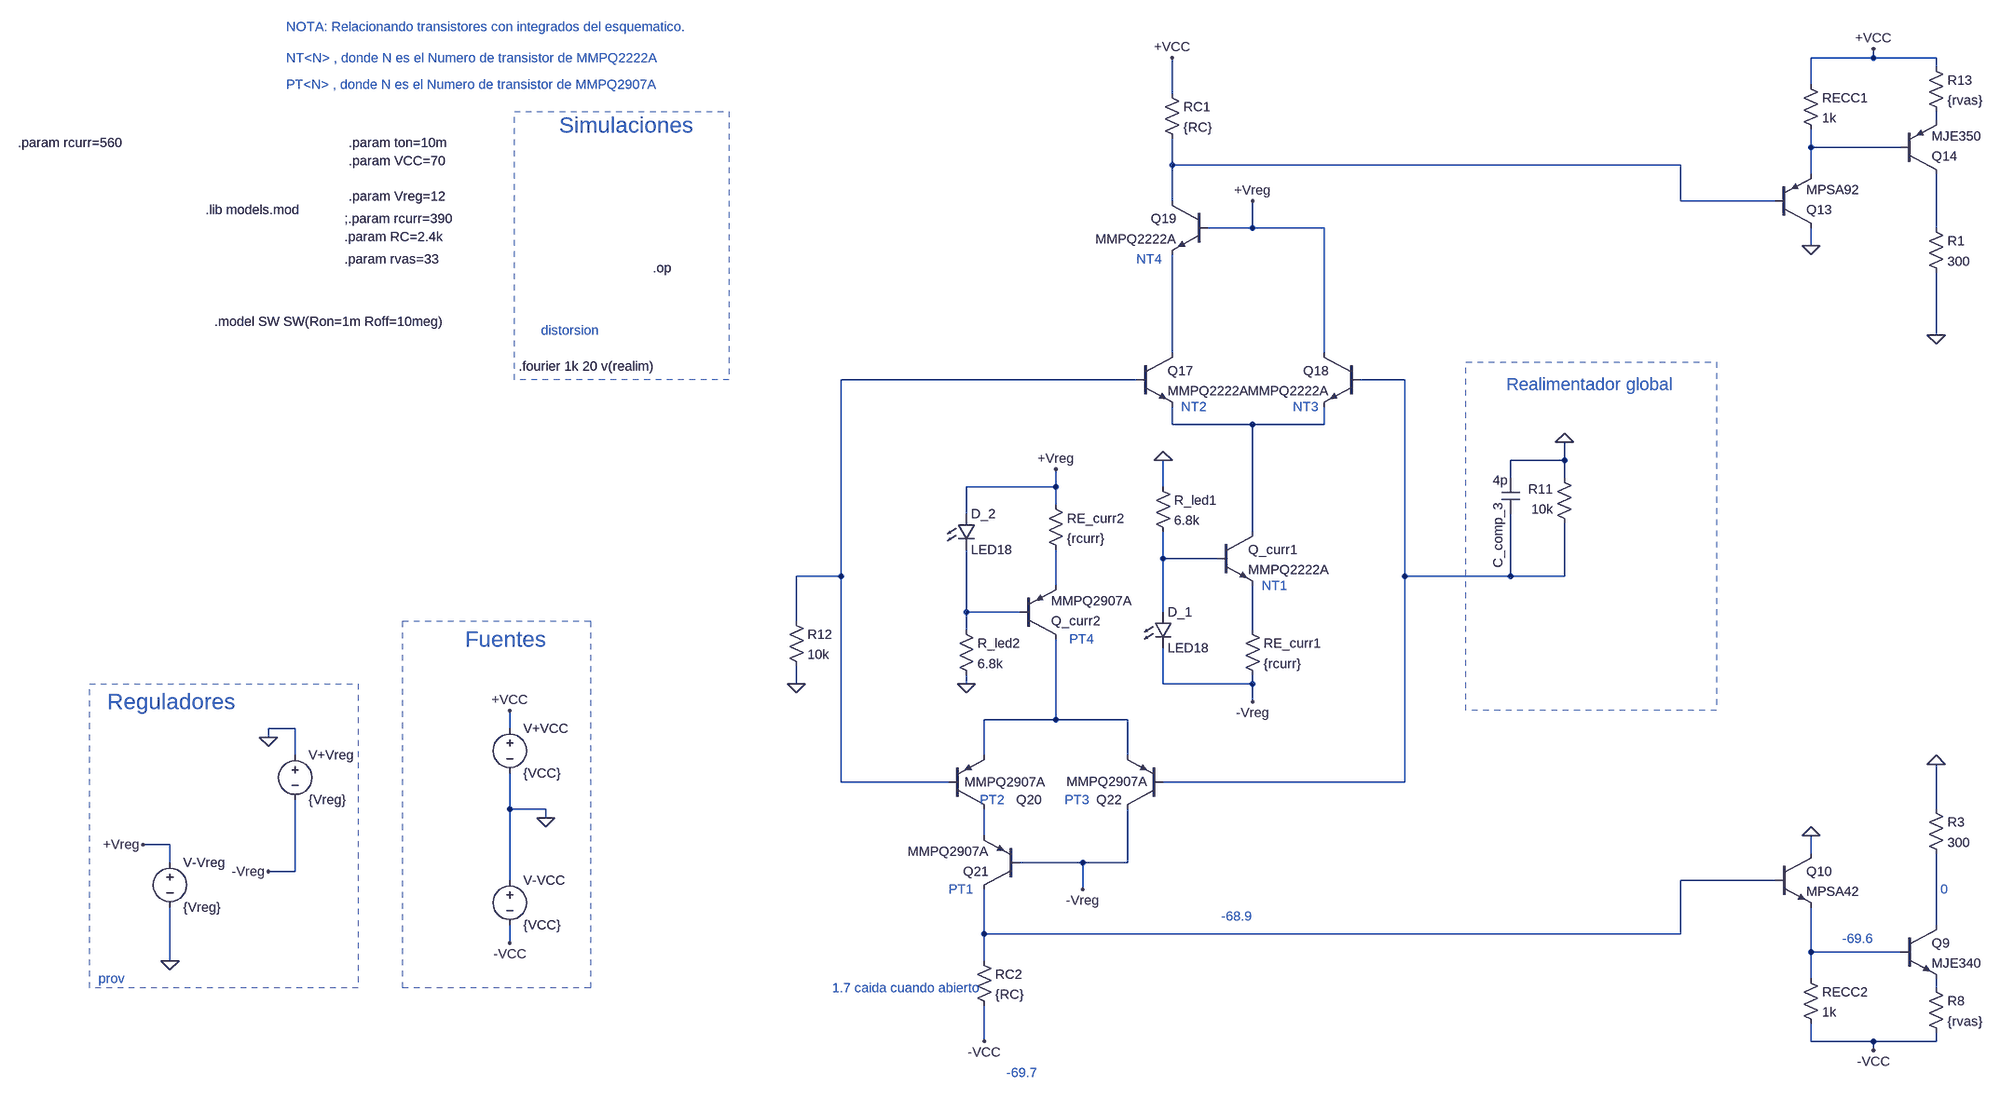
[diagram p0: schematic segunda-etapa-v2_kaaha.asc]
segunda-etapa-v2_kaaha.asc, the LTspice schematic file:
Version 4
SHEET 1 6132 2164
WIRE 1792 -752 1792 -768
WIRE 1792 -752 1680 -752
WIRE 1904 -752 1792 -752
WIRE 1904 -736 1904 -752
WIRE 1680 -704 1680 -752
WIRE 464 -688 464 -752
WIRE 1904 -640 1904 -656
WIRE 1680 -592 1680 -624
WIRE 1840 -592 1680 -592
WIRE 464 -560 464 -608
WIRE 1392 -560 464 -560
WIRE 1680 -544 1680 -592
WIRE 464 -496 464 -560
WIRE 1392 -496 1392 -560
WIRE 1616 -496 1392 -496
WIRE 608 -448 608 -496
WIRE 608 -448 528 -448
WIRE 736 -448 608 -448
WIRE 1904 -448 1904 -544
WIRE 1680 -416 1680 -448
WIRE 1904 -256 1904 -368
WIRE 464 -224 464 -400
WIRE 736 -224 736 -448
WIRE 400 -176 -128 -176
WIRE 880 -176 800 -176
WIRE 464 -96 464 -128
WIRE 608 -96 464 -96
WIRE 736 -96 736 -128
WIRE 736 -96 608 -96
WIRE 1184 -32 1184 -64
WIRE 1184 -32 1088 -32
WIRE 1088 0 1088 -32
WIRE 1184 0 1184 -32
WIRE 256 16 256 -16
WIRE 256 16 96 16
WIRE 448 16 448 -32
WIRE 256 48 256 16
WIRE 96 64 96 16
WIRE 608 96 608 -96
WIRE 448 144 448 96
WIRE 544 144 448 144
WIRE -128 176 -128 -176
WIRE -128 176 -208 176
WIRE 880 176 880 -176
WIRE 1088 176 1088 64
WIRE 1088 176 880 176
WIRE 1184 176 1184 80
WIRE 1184 176 1088 176
WIRE 256 192 256 128
WIRE 96 240 96 128
WIRE 192 240 96 240
WIRE 448 240 448 144
WIRE -208 256 -208 176
WIRE 96 272 96 240
WIRE 608 272 608 192
WIRE -208 368 -208 336
WIRE 96 368 96 352
WIRE 448 368 448 304
WIRE 608 368 608 352
WIRE 608 368 448 368
WIRE 608 400 608 368
WIRE 256 432 256 288
WIRE 256 432 128 432
WIRE 384 432 256 432
WIRE -1568 448 -1616 448
WIRE -1184 448 -1184 416
WIRE -1616 464 -1616 448
WIRE -1568 496 -1568 448
WIRE 128 496 128 432
WIRE 384 496 384 432
WIRE -128 544 -128 176
WIRE 64 544 -128 544
WIRE 880 544 880 176
WIRE 880 544 448 544
WIRE -1184 592 -1184 528
WIRE -1120 592 -1184 592
WIRE 1904 592 1904 512
WIRE -1120 608 -1120 592
WIRE 128 640 128 592
WIRE -1792 656 -1840 656
WIRE 1680 672 1680 640
WIRE -1792 688 -1792 656
WIRE 304 688 192 688
WIRE 384 688 384 592
WIRE 384 688 304 688
WIRE -1568 704 -1568 576
WIRE -1568 704 -1616 704
WIRE -1184 720 -1184 592
WIRE 1616 720 1392 720
WIRE 304 736 304 688
WIRE 1904 800 1904 672
WIRE 128 816 128 736
WIRE 1392 816 1392 720
WIRE 1392 816 128 816
WIRE -1184 832 -1184 800
WIRE 1680 848 1680 768
WIRE 1840 848 1680 848
WIRE -1792 864 -1792 768
WIRE 128 864 128 816
WIRE 1680 896 1680 848
WIRE 1904 912 1904 896
WIRE 128 1008 128 944
WIRE 1680 1008 1680 976
WIRE 1792 1008 1680 1008
WIRE 1904 1008 1904 992
WIRE 1904 1008 1792 1008
WIRE 1792 1024 1792 1008
FLAG -1120 608 0
FLAG -1184 416 +VCC
FLAG -1184 832 -VCC
FLAG -208 368 0
FLAG 1680 -416 0
FLAG 1680 640 0
FLAG -1840 656 +Vreg
FLAG -1616 704 -Vreg
FLAG 608 -496 +Vreg
FLAG 608 400 -Vreg
FLAG 256 -16 +Vreg
FLAG 304 736 -Vreg
FLAG 96 368 0
FLAG 448 -32 0
FLAG -1792 864 0
FLAG -1616 464 0
FLAG 464 -752 +VCC
FLAG 128 1008 -VCC
FLAG 1792 -768 +VCC
FLAG 1792 1024 -VCC
FLAG 1184 -64 0
FLAG 1904 -256 0
FLAG 1904 512 0
SYMBOL voltage -1184 432 R0
WINDOW 123 0 0 Left 2
WINDOW 39 0 0 Left 2
SYMATTR InstName V+VCC
SYMATTR Value {VCC}
SYMBOL voltage -1184 704 R0
WINDOW 123 0 0 Left 2
WINDOW 39 0 0 Left 2
SYMATTR InstName V-VCC
SYMATTR Value {VCC}
SYMBOL npn 1840 800 R0
SYMATTR InstName Q9
SYMATTR Value MJE340
SYMBOL res 1888 896 R0
SYMATTR InstName R8
SYMATTR Value {rvas}
SYMBOL npn 1616 672 R0
SYMATTR InstName Q10
SYMATTR Value MPSA42
SYMBOL res 1200 96 R180
WINDOW 0 36 76 Left 2
WINDOW 3 36 40 Left 2
SYMATTR InstName R11
SYMATTR Value 10k
SYMBOL res -224 240 R0
SYMATTR InstName R12
SYMATTR Value 10k
SYMBOL pnp 1616 -448 M180
SYMATTR InstName Q13
SYMATTR Value MPSA92
SYMBOL pnp 1840 -544 M180
SYMATTR InstName Q14
SYMATTR Value MJE350
SYMBOL res 1888 -752 R0
SYMATTR InstName R13
SYMATTR Value {rvas}
SYMBOL cap 1104 64 R180
WINDOW 0 38 20 VLeft 2
WINDOW 3 21 60 Left 2
SYMATTR InstName C_comp_3
SYMATTR Value 4p
SYMBOL voltage -1568 480 R0
WINDOW 123 0 0 Left 2
WINDOW 39 0 0 Left 2
SYMATTR InstName V+Vreg
SYMATTR Value {Vreg}
SYMBOL npn 544 96 R0
SYMATTR InstName Q_curr1
SYMATTR Value MMPQ2222A
SYMBOL npn 400 -224 R0
SYMATTR InstName Q17
SYMATTR Value MMPQ2222A
SYMBOL npn 800 -224 M0
SYMATTR InstName Q18
SYMATTR Value MMPQ2222A
SYMBOL res 432 0 R0
SYMATTR InstName R_led1
SYMATTR Value 6.8k
SYMBOL res 592 256 R0
SYMATTR InstName RE_curr1
SYMATTR Value {rcurr}
SYMBOL LED 432 240 R0
SYMATTR InstName D_1
SYMATTR Value LED18
SYMBOL res 448 -704 R0
SYMATTR InstName RC1
SYMATTR Value {RC}
SYMBOL npn 528 -496 M0
SYMATTR InstName Q19
SYMATTR Value MMPQ2222A
SYMBOL res 240 32 R0
SYMATTR InstName RE_curr2
SYMATTR Value {rcurr}
SYMBOL pnp 192 288 M180
SYMATTR InstName Q_curr2
SYMATTR Value MMPQ2907A
SYMBOL pnp 64 592 M180
WINDOW 0 121 16 Left 2
WINDOW 3 29 48 Left 2
SYMATTR InstName Q20
SYMATTR Value MMPQ2907A
SYMBOL pnp 192 736 R180
SYMATTR InstName Q21
SYMATTR Value MMPQ2907A
SYMBOL res 112 848 R0
SYMATTR InstName RC2
SYMATTR Value {RC}
SYMBOL pnp 448 592 R180
WINDOW 0 74 16 Left 2
WINDOW 3 28 49 Left 2
SYMATTR InstName Q22
SYMATTR Value MMPQ2907A
SYMBOL LED 80 64 R0
SYMATTR InstName D_2
SYMATTR Value LED18
SYMBOL res 80 256 R0
SYMATTR InstName R_led2
SYMATTR Value 6.8k
SYMBOL res 1664 880 R0
SYMATTR InstName RECC2
SYMATTR Value 1k
SYMBOL res 1664 -720 R0
SYMATTR InstName RECC1
SYMATTR Value 1k
SYMBOL voltage -1792 672 R0
WINDOW 123 0 0 Left 2
WINDOW 39 0 0 Left 2
SYMATTR InstName V-Vreg
SYMATTR Value {Vreg}
SYMBOL res 1888 -464 R0
SYMATTR InstName R1
SYMATTR Value 300
SYMBOL res 1888 576 R0
SYMATTR InstName R3
SYMATTR Value 300
TEXT -1168 -200 Left 2 !.fourier 1k 20 v(realim)
TEXT -1264 288 Left 4 ;Fuentes
TEXT -1096 -632 Left 4 ;Simulaciones
TEXT -1128 -264 Left 2 ;distorsion
TEXT -1728 -480 Left 2 !.lib models.mod
TEXT -1904 400 Left 4 ;Reguladores
TEXT -1920 896 Left 2 ;prov
TEXT 1080 -168 Left 3 ;Realimentador global
TEXT 480 -128 Left 2 ;NT2
TEXT 680 -128 Left 2 ;NT3
TEXT 624 192 Left 2 ;NT1
TEXT 400 -392 Left 2 ;NT4
TEXT 120 576 Left 2 ;PT2
TEXT -1584 -752 Left 2 ;NT<N> , donde N es el Numero de transistor de MMPQ2222A
TEXT -1584 -704 Left 2 ;PT<N> , donde N es el Numero de transistor de MMPQ2907A
TEXT -1584 -808 Left 2 ;NOTA: Relacionando transistores con integrados del esquematico.
TEXT 64 736 Left 2 ;PT1
TEXT 272 576 Left 2 ;PT3
TEXT 280 288 Left 2 ;PT4
TEXT -1472 -568 Left 2 !.param VCC=70
TEXT -1472 -504 Left 2 !.param Vreg=12
TEXT -1480 -432 Left 2 !.param RC=2.4k
TEXT -1480 -392 Left 2 !.param rvas=33
TEXT -1480 -464 Left 2 !;.param rcurr=390
TEXT -1472 -600 Left 2 !.param ton=10m
TEXT -2064 -600 Left 2 !.param rcurr=560
TEXT -1712 -280 Left 2 !.model SW SW(Ron=1m Roff=10meg)
TEXT 168 1064 Left 2 ;-69.7
TEXT 552 784 Left 2 ;-68.9
TEXT 1912 736 Left 2 ;0
TEXT -144 912 Left 2 ;1.7 caida cuando abierto
TEXT 1736 824 Left 2 ;-69.6
TEXT -928 -376 Left 2 !.op
RECTANGLE Normal -1040 912 -1376 256 2
RECTANGLE Normal -792 -176 -1176 -656 2
RECTANGLE Normal -1456 912 -1936 368 2
RECTANGLE Normal 1456 416 1008 -208 2

The netlist it stands for:
* segunda-etapa-v2_kaaha.asc
V+VCC +VCC 0 {VCC}
V-VCC 0 -VCC {VCC}
Q9 N016 N017 N018 0 MJE340
R8 N018 -VCC {rvas}
Q10 0 N015 N017 0 MPSA42
R11 N007 0 10k
R12 N006 0 10k
Q13 0 N003 N002 0 MPSA92
Q14 N004 N002 N001 0 MJE350
R13 +VCC N001 {rvas}
C_comp_3 N007 0 4p
V+Vreg 0 -Vreg {Vreg}
Q_curr1 N008 N009 N012 0 MMPQ2222A
Q17 N005 N006 N008 0 MMPQ2222A
Q18 +Vreg N007 N008 0 MMPQ2222A
R_led1 0 N009 6.8k
RE_curr1 N012 -Vreg {rcurr}
D_1 N009 -Vreg LED18
RC1 +VCC N003 {RC}
Q19 N003 +Vreg N005 0 MMPQ2222A
RE_curr2 +Vreg N010 {rcurr}
Q_curr2 N013 N011 N010 0 MMPQ2907A
Q20 N014 N006 N013 0 MMPQ2907A
Q21 N015 -Vreg N014 0 MMPQ2907A
RC2 N015 -VCC {RC}
Q22 -Vreg N007 N013 0 MMPQ2907A
D_2 +Vreg N011 LED18
R_led2 N011 0 6.8k
RECC2 N017 -VCC 1k
RECC1 +VCC N002 1k
V-Vreg +Vreg 0 {Vreg}
R1 N004 0 300
R3 0 N016 300
.model D D
.lib standard.dio
.model NPN NPN
.model PNP PNP
.lib standard.bjt
.fourier 1k 20 v(realim)
* Fuentes
* Simulaciones
* distorsion
.lib models.mod
* Reguladores
* prov
* Realimentador global
* NT2
* NT3
* NT1
* NT4
* PT2
* NT<N> , donde N es el Numero de transistor de MMPQ2222A
* PT<N> , donde N es el Numero de transistor de MMPQ2907A
* NOTA: Relacionando transistores con integrados del esquematico.
* PT1
* PT3
* PT4
.param VCC=70
.param Vreg=12
.param RC=2.4k
.param rvas=33
;.param rcurr=390
.param ton=10m
.param rcurr=560
.model SW SW(Ron=1m Roff=10meg)
* -69.7
* -68.9
* 0
* 1.7 caida cuando abierto
* -69.6
.op
.backanno
.end